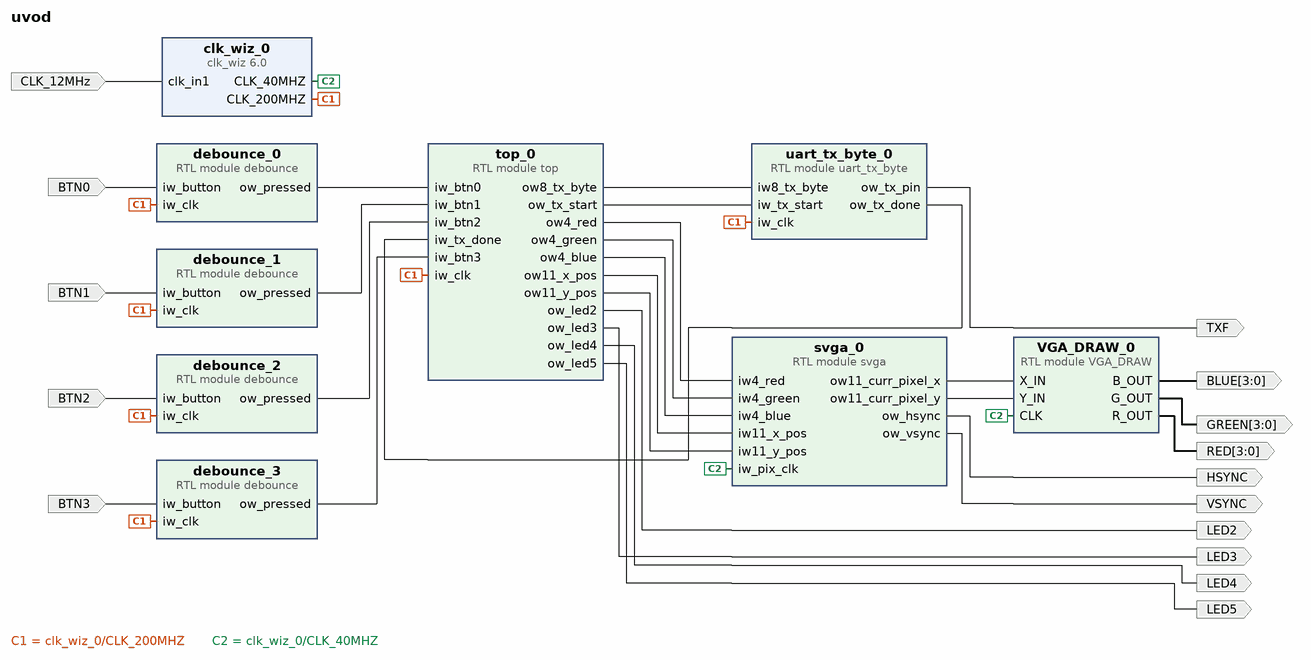
[diagram p0: block diagram of the top level]
# Vivado block design uvod, xc7s25csga324-1, Vivado 2019.1
create_bd_design uvod

create_bd_port -dir O LED2
create_bd_port -dir O LED3
create_bd_port -dir O LED4
create_bd_port -dir O LED5
create_bd_port -dir I -type clk CLK_12MHz
set_property -dict {CONFIG.FREQ_HZ 12000000} [get_bd_ports CLK_12MHz]
create_bd_port -dir I BTN0
create_bd_port -dir I BTN1
create_bd_port -dir I BTN2
create_bd_port -dir I BTN3
create_bd_port -dir O -from 3 -to 0 RED
create_bd_port -dir O -from 3 -to 0 GREEN
create_bd_port -dir O -from 3 -to 0 BLUE
create_bd_port -dir O HSYNC
create_bd_port -dir O VSYNC
create_bd_port -dir O TXF

create_bd_cell -type module -reference top top_0
create_bd_cell -type module -reference debounce debounce_0
create_bd_cell -type module -reference debounce debounce_1
create_bd_cell -type module -reference debounce debounce_2
create_bd_cell -type module -reference debounce debounce_3
create_bd_cell -type ip -vlnv xilinx.com:ip:clk_wiz:6.0 clk_wiz_0
set_property -dict [list \
  CONFIG.CLKOUT1_DRIVES BUFG \
  CONFIG.CLKOUT1_JITTER 522.440 \
  CONFIG.CLKOUT1_PHASE_ERROR 613.025 \
  CONFIG.CLKOUT1_REQUESTED_OUT_FREQ 200.000 \
  CONFIG.CLKOUT1_USED true \
  CONFIG.CLKOUT2_DRIVES BUFG \
  CONFIG.CLKOUT2_JITTER 686.725 \
  CONFIG.CLKOUT2_PHASE_ERROR 613.025 \
  CONFIG.CLKOUT2_REQUESTED_OUT_FREQ 40.000 \
  CONFIG.CLKOUT2_USED true \
  CONFIG.CLKOUT3_DRIVES BUFG \
  CONFIG.CLKOUT4_DRIVES BUFG \
  CONFIG.CLKOUT5_DRIVES BUFG \
  CONFIG.CLKOUT6_DRIVES BUFG \
  CONFIG.CLKOUT7_DRIVES BUFG \
  CONFIG.CLK_OUT1_PORT CLK_200MHZ \
  CONFIG.CLK_OUT2_PORT CLK_40MHZ \
  CONFIG.FEEDBACK_SOURCE FDBK_AUTO \
  CONFIG.MMCM_BANDWIDTH OPTIMIZED \
  CONFIG.MMCM_CLKFBOUT_MULT_F 50.000 \
  CONFIG.MMCM_CLKOUT0_DIVIDE_F 3.000 \
  CONFIG.MMCM_CLKOUT1_DIVIDE 15 \
  CONFIG.MMCM_COMPENSATION ZHOLD \
  CONFIG.NUM_OUT_CLKS 2 \
  CONFIG.PRIMITIVE MMCM \
  CONFIG.USE_LOCKED false \
  CONFIG.USE_RESET false \
] [get_bd_cells clk_wiz_0]
create_bd_cell -type module -reference uart_tx_byte uart_tx_byte_0
create_bd_cell -type module -reference svga svga_0
create_bd_cell -type module -reference VGA_DRAW VGA_DRAW_0

# ---- connections ----

connect_bd_net [get_bd_pins top_0/ow_led2] [get_bd_ports LED2]
connect_bd_net [get_bd_pins top_0/ow_led3] [get_bd_ports LED3]
connect_bd_net [get_bd_pins top_0/ow_led4] [get_bd_ports LED4]
connect_bd_net [get_bd_pins top_0/ow_led5] [get_bd_ports LED5]
connect_bd_net [get_bd_pins debounce_0/ow_pressed] [get_bd_pins top_0/iw_btn0]
connect_bd_net [get_bd_pins debounce_1/ow_pressed] [get_bd_pins top_0/iw_btn1]
connect_bd_net [get_bd_pins debounce_2/ow_pressed] [get_bd_pins top_0/iw_btn2]
connect_bd_net [get_bd_pins debounce_3/ow_pressed] [get_bd_pins top_0/iw_btn3]
connect_bd_net -net iw_button_0_1 [get_bd_ports BTN0] [get_bd_pins debounce_0/iw_button]
connect_bd_net -net iw_button_1_1 [get_bd_ports BTN1] [get_bd_pins debounce_1/iw_button]
connect_bd_net -net iw_button_2_1 [get_bd_ports BTN2] [get_bd_pins debounce_2/iw_button]
connect_bd_net -net iw_button_3_1 [get_bd_ports BTN3] [get_bd_pins debounce_3/iw_button]
connect_bd_net [get_bd_ports CLK_12MHz] [get_bd_pins clk_wiz_0/clk_in1]
connect_bd_net -net clk_wiz_0_clk_out1 [get_bd_pins clk_wiz_0/CLK_200MHZ] \
  [get_bd_pins debounce_0/iw_clk] [get_bd_pins debounce_1/iw_clk] [get_bd_pins debounce_2/iw_clk] \
  [get_bd_pins debounce_3/iw_clk] [get_bd_pins top_0/iw_clk] [get_bd_pins uart_tx_byte_0/iw_clk]
connect_bd_net [get_bd_pins top_0/ow4_red] [get_bd_pins svga_0/iw4_red]
connect_bd_net [get_bd_pins top_0/ow4_green] [get_bd_pins svga_0/iw4_green]
connect_bd_net [get_bd_pins top_0/ow4_blue] [get_bd_pins svga_0/iw4_blue]
connect_bd_net [get_bd_pins top_0/ow11_x_pos] [get_bd_pins svga_0/iw11_x_pos]
connect_bd_net [get_bd_pins top_0/ow11_y_pos] [get_bd_pins svga_0/iw11_y_pos]
connect_bd_net [get_bd_pins top_0/ow8_tx_byte] [get_bd_pins uart_tx_byte_0/iw8_tx_byte]
connect_bd_net [get_bd_pins top_0/ow_tx_start] [get_bd_pins uart_tx_byte_0/iw_tx_start]
connect_bd_net [get_bd_pins svga_0/ow_vsync] [get_bd_ports VSYNC]
connect_bd_net [get_bd_pins uart_tx_byte_0/ow_tx_pin] [get_bd_ports TXF]
connect_bd_net [get_bd_pins uart_tx_byte_0/ow_tx_done] [get_bd_pins top_0/iw_tx_done]
connect_bd_net [get_bd_pins clk_wiz_0/CLK_40MHZ] [get_bd_pins svga_0/iw_pix_clk] [get_bd_pins VGA_DRAW_0/CLK]
connect_bd_net -net svga_0_ow_cursor_x [get_bd_pins svga_0/ow11_curr_pixel_x] [get_bd_pins VGA_DRAW_0/X_IN]
connect_bd_net [get_bd_pins VGA_DRAW_0/G_OUT] [get_bd_ports GREEN]
connect_bd_net [get_bd_pins VGA_DRAW_0/B_OUT] [get_bd_ports BLUE]
connect_bd_net [get_bd_pins svga_0/ow_hsync] [get_bd_ports HSYNC]
connect_bd_net -net svga_0_ow_cursor_y [get_bd_pins svga_0/ow11_curr_pixel_y] [get_bd_pins VGA_DRAW_0/Y_IN]
connect_bd_net [get_bd_pins VGA_DRAW_0/R_OUT] [get_bd_ports RED]

validate_bd_design
save_bd_design
